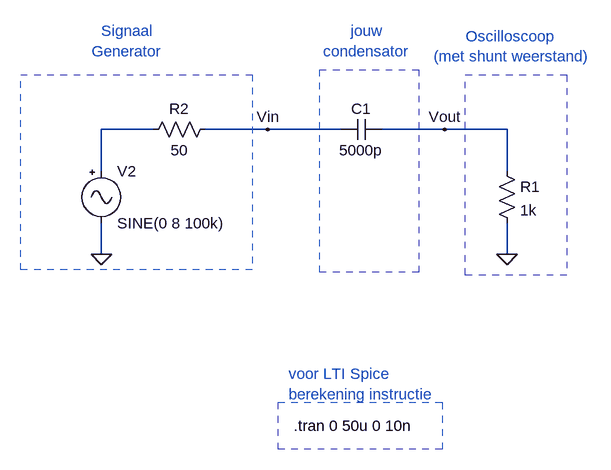
[diagram p0: schematic LTSpiceTemplateCapacitor (1).asc]
LTSpiceTemplateCapacitor (1).asc, the LTspice schematic file:
Version 4
SHEET 1 880 752
WIRE -112 256 -192 256
WIRE 64 256 -32 256
WIRE 176 256 64 256
WIRE 336 256 240 256
WIRE 432 256 336 256
WIRE -192 320 -192 256
WIRE 432 320 432 256
WIRE -192 448 -192 400
WIRE 432 448 432 400
FLAG -192 448 0
FLAG 432 448 0
FLAG 336 256 Vout
FLAG 64 256 Vin
SYMBOL cap 240 240 R90
WINDOW 0 0 32 VBottom 2
WINDOW 3 32 32 VTop 2
SYMATTR InstName C1
SYMATTR Value 5000p
SYMBOL res 416 304 R0
SYMATTR InstName R1
SYMATTR Value 1k
SYMBOL Misc/signal -192 304 R0
SYMATTR InstName V2
SYMATTR Value SINE(0 8 100k)
SYMBOL res -128 272 R270
WINDOW 0 32 56 VTop 2
WINDOW 3 0 56 VBottom 2
SYMATTR InstName R2
SYMATTR Value 50
TEXT 104 712 Left 2 !.tran 0 50u 0 10n
TEXT -152 120 Center 2 ;Signaal\nGenerator
TEXT 440 128 Center 2 ;Oscilloscoop \n(met shunt weerstand)
TEXT 216 120 Center 2 ;jouw\ncondensator
TEXT 96 632 Left 2 ;voor LTI Spice\nberekening instructie
RECTANGLE Normal -316 172 40 472 2
RECTANGLE Normal 368 172 524 480 2
RECTANGLE Normal 144 164 296 476 2
RECTANGLE Normal 80 676 332 748 2

The netlist it stands for:
* LTSpiceTemplateCapacitor (1).asc
C1 Vout Vin 5000p
R1 Vout 0 1k
V2 N001 0 SINE(0 8 100k)
R2 N001 Vin 50
.tran 0 50u 0 10n
* Signaal
* Generator
* Oscilloscoop
* (met shunt weerstand)
* jouw
* condensator
* voor LTI Spice
* berekening instructie
.backanno
.end